# Altium schematic sheet serial_4.SchDoc
size A
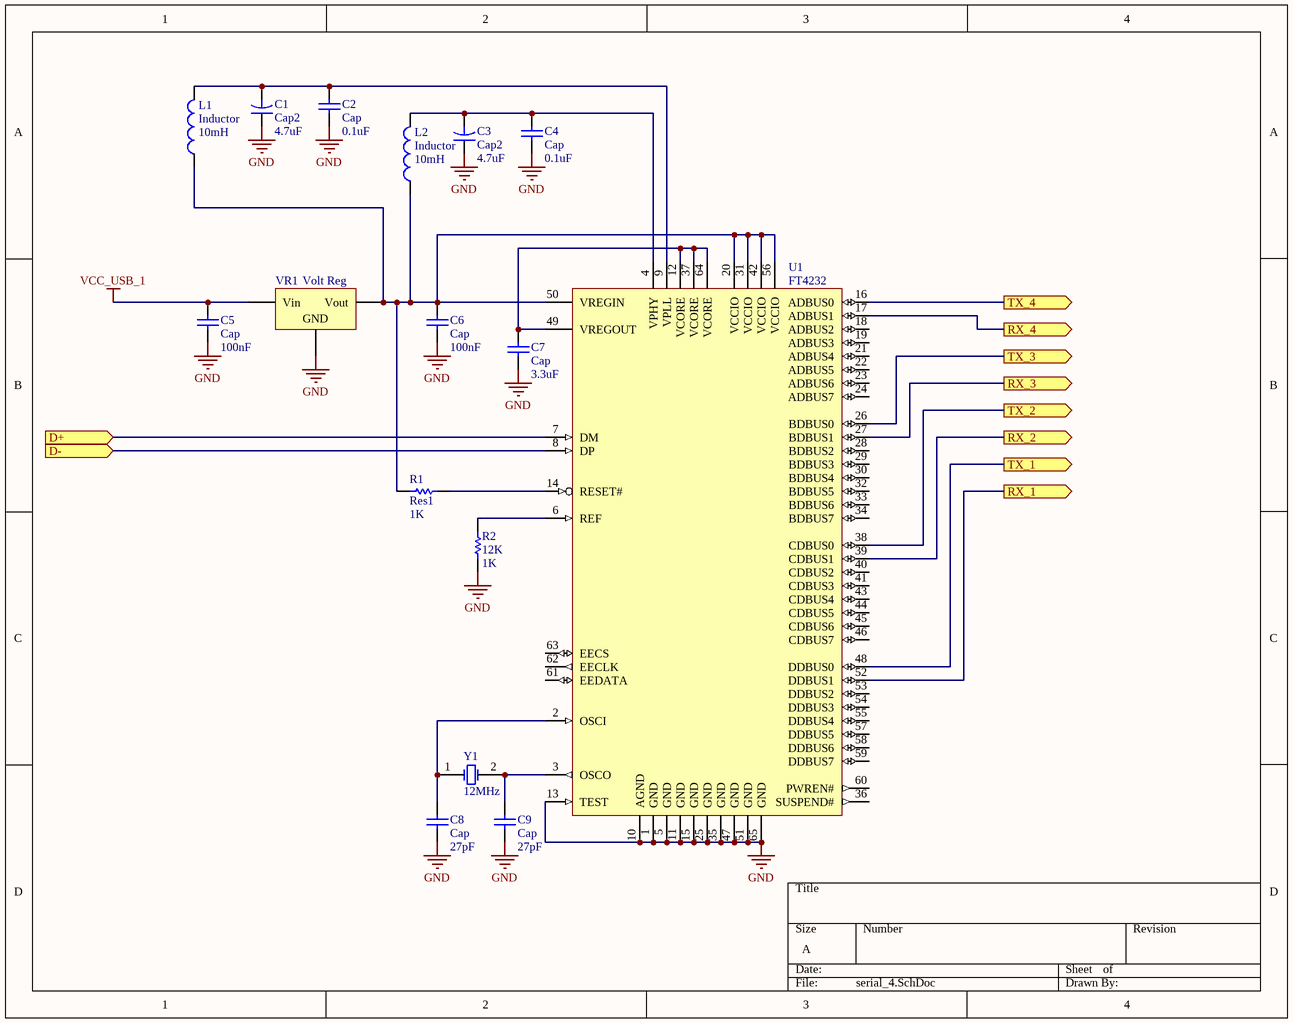
[diagram p0: serial_4.SchDoc]

## Parts
C1  Cap2  value 4.7uF  [CAPR5-4X5]
C2  Cap  value 0.1uF  [C0805]
C3  Cap2  value 4.7uF  [CAPR5-4X5]
C4  Cap  value 0.1uF  [C0805]
C5  Cap  value 100nF  [C0805]
C6  Cap  value 100nF  [C0805]
C7  Cap  value 3.3uF  [C0805]
C8  Cap  value 27pF  [C0805]
C9  Cap  value 27pF  [C0805]
L1  Inductor  value 10mH  [C0805]
L2  Inductor  value 10mH  [C0805]
R1  Res1  value 1K  [0805R-1K]
R2  12K  value 1K  [0805R-12K]
U1  FT4232  [QFN64_2_N]
VR1  Volt Reg  [SOT223]
Y1  12MHz  [XTAL-HC49US-7MM]

## Ports
D+ (in), D- (in), RX_1 (out), RX_2 (out), RX_3 (out), RX_4 (out), TX_1 (out), TX_2 (out), TX_3 (out), TX_4 (out)

## Nets
GND: C1.1 C2.1 C3.1 C4.1 C5.1 C6.1 C7.1 C8.1 C9.1 R2.1 U1.1(GND) U1.5(GND) U1.10(AGND) U1.11(GND) U1.13(TEST) U1.15(GND) U1.25(GND) U1.35(GND) U1.47(GND) U1.51(GND) U1.65(GND) VR1.2(GND)
VCC_USB_1: C5.2 VR1.1(Vin)
D+: U1.7(DM) ; port D+
D-: U1.8(DP) ; port D-
RX_1: U1.52(DDBUS1) ; port RX_1
RX_2: U1.39(CDBUS1) ; port RX_2
RX_3: U1.27(BDBUS1) ; port RX_3
RX_4: U1.17(ADBUS1) ; port RX_4
TX_1: U1.48(DDBUS0) ; port TX_1
TX_2: U1.38(CDBUS0) ; port TX_2
TX_3: U1.26(BDBUS0) ; port TX_3
TX_4: U1.16(ADBUS0) ; port TX_4
NetC1_2: C1.2 C2.2 L1.2 U1.9(VPLL)
NetC3_2: C3.2 C4.2 L2.2 U1.4(VPHY)
NetC6_2: C6.2 L1.1 L2.1 R1.2 U1.20(VCCIO) U1.31(VCCIO) U1.42(VCCIO) U1.50(VREGIN) U1.56(VCCIO) VR1.3(Vout)
NetC7_2: C7.2 U1.12(VCORE) U1.37(VCORE) U1.49(VREGOUT) U1.64(VCORE)
NetC8_2: C8.2 U1.2(OSCI) Y1.1(OSC1)
NetC9_2: C9.2 U1.3(OSCO) Y1.2(OSC2)
NetR1_1: R1.1 U1.14(RESET#)
NetR2_2: R2.2 U1.6(REF)

Not connected (* = marked no-connect by the designer): U1 18(ADBUS2) 19(ADBUS3) 21(ADBUS4) 22(ADBUS5) 23(ADBUS6) 24(ADBUS7) 28(BDBUS2) 29(BDBUS3) 30(BDBUS4) 32(BDBUS5) 33(BDBUS6) 34(BDBUS7) 36(SUSPEND#) 40(CDBUS2) 41(CDBUS3) 43(CDBUS4) 44(CDBUS5) 45(CDBUS6) 46(CDBUS7) 53(DDBUS2) 54(DDBUS3) 55(DDBUS4) 57(DDBUS5) 58(DDBUS6) 59(DDBUS7) 60(PWREN#) 61(EEDATA) 62(EECLK) 63(EECS)

## Library data of the parts
C1 C3 = Cap2: Capacitor; Published: 23-Sep-2002; PackageReference: CAPR5-4X5; Publisher: Altium Limited; PackageDescription: Capacitor; 2 Leads
C2 C4-C9 = Cap: Capacitor; Published: 8-Jun-2000; LatestRevisionDate: 17-Jul-2002; LatestRevisionNote: Re-released for DXP Platform.; PackageReference: RAD-0.3; Publisher: Altium Limited; PackageDescription: Radial Cap, Thru-Hole; 2 Leads; 0.3 in Pin Spacing
L1 L2 = Inductor: Code_IEC: 1005; Published: 8-Jun-2000; LatestRevisionDate: 29-May-2009; LatestRevisionNote: IPC-7351 Footprint Added.; PackageReference: 0402-A; Publisher: Altium Limited; PackageDescription: Chip Inductor; Code_JEITA: 0402
R1 R2 = Res1: Resistor; Published: 8-Jun-2000; LatestRevisionDate: 17-Jul-2002; LatestRevisionNote: Re-released for DXP Platform.; PackageReference: AXIAL-0.3; Publisher: Altium Limited; PackageDescription: Axial Device, Thru-Hole; 2 Leads; 0.3 in Pin Spacing
U1 = FT4232HQ-Tray: Quad High Speed USB To Multipurpose UART/MPSSE IC, QFN-64, Tray; Published: 30-Aug-2010; DatasheetVersion: ver 2.08, May-2010; PackageVersion: 2010; PackageReference: QFN64_2; Publisher: Altium Limited; PackageDescription: 64-Pin Quad Flat No-Lead, 9 x 9 mm Body, 0.5 mm Pitch, 4.35 x 4.35 mm Exposed Pad; ComponentLink1Description: Manufacturer Link; ComponentLink1URL: http://www.ftdichip.com/Products/ICs/FT4232H.htm; ComponentLink2Description: Datasheet; ComponentLink2URL: http://www.ftdichip.com/Support/Documents/DataSheets/ICs/DS_FT4232H.pdf
VR1 = Volt Reg: Voltage Regulator; Published: 24-Mar-1999; LatestRevisionDate: 29-May-2009; LatestRevisionNote: IPC-7351 Footprint Added.; PackageReference: D2PAK; Publisher: Altium Limited; PackageDescription: 3-Pin Transistor Outline Package 2.54 mm Pitch, 15.1 mm Lead Span
Y1 = XTAL: Crystal Oscillator; Published: 8-Jun-2000; LatestRevisionDate: 17-Jul-2002; LatestRevisionNote: Re-released for DXP Platform.; PackageReference: R38; Publisher: Altium Limited; PackageDescription: Crystal, Thru-Hole; 2 Leads; Body 3.1 x 8.2 mm (Dia.xH)